# EAGLE design circuit (EAGLE 5.11)
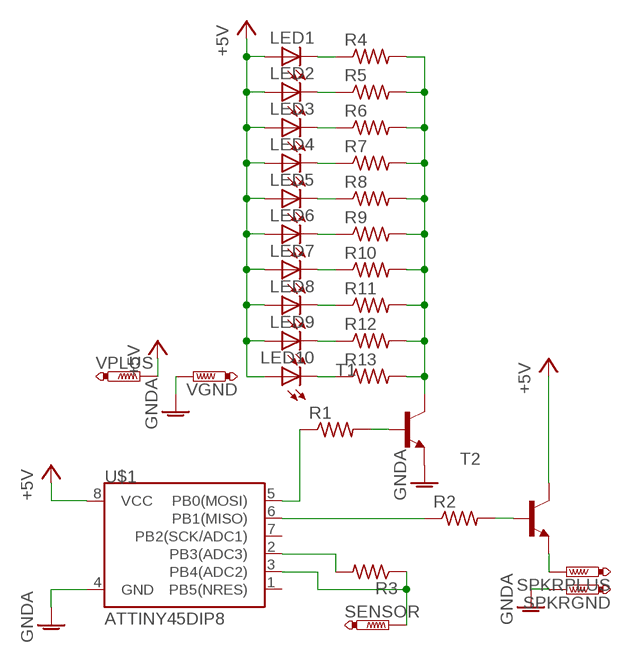
[diagram p0: schematic, sheet 1]

## Parts
LED1  LED5MM  [LED5MM]
LED2  LED5MM  [LED5MM]
LED3  LED5MM  [LED5MM]
LED4  LED5MM  [LED5MM]
LED5  LED5MM  [LED5MM]
LED6  LED5MM  [LED5MM]
LED7  LED5MM  [LED5MM]
LED8  LED5MM  [LED5MM]
LED9  LED5MM  [LED5MM]
LED10  LED5MM  [LED5MM]
R1  R-US_0204/5  [0204/5]
R2  R-US_0204/5  [0204/5]
R3  R-US_0204/5  [0204/5]
R4  R-US_0204/5  [0204/5]
R5  R-US_0204/5  [0204/5]
R6  R-US_0204/5  [0204/5]
R7  R-US_0204/5  [0204/5]
R8  R-US_0204/5  [0204/5]
R9  R-US_0204/5  [0204/5]
R10  R-US_0204/5  [0204/5]
R11  R-US_0204/5  [0204/5]
R12  R-US_0204/5  [0204/5]
R13  R-US_0204/5  [0204/5]
SENSOR  PTR1PAD1-17Y  [P1-17Y]
SPKRGND  PTR1PAD1-17Y  [P1-17Y]
SPKRPLUS  PTR1PAD1-17Y  [P1-17Y]
T1  -NPN-TO92-EBC  [TO92-EBC]
T2  -NPN-TO92-EBC  [TO92-EBC]
U$1  ATTINY45DIP8  [DIP08]
VGND  PTR1PAD1-17Y  [P1-17Y]
VPLUS  PTR1PAD1-17Y  [P1-17Y]

## Nets
+5V: LED1.A LED2.A LED3.A LED4.A LED5.A LED6.A LED7.A LED8.A LED9.A LED10.A T2.C U$1.8(VCC) VPLUS.TP
GNDA: SPKRGND.TP T1.E U$1.4(GND) VGND.TP
N$1: R3.2 U$1.2(PB3(ADC3))
N$3: R2.1 U$1.6(PB1(MISO))
N$4: R2.2 T2.B
N$5: R4.2 R5.2 R6.2 R7.2 R8.2 R9.2 R10.2 R11.2 R12.2 R13.2 T1.C
N$6: R1.2 T1.B
N$7: R1.1 U$1.5(PB0(MOSI))
N$8: SPKRPLUS.TP T2.E
N$9: LED1.K(C) R4.1
N$10: LED2.K(C) R5.1
N$11: LED3.K(C) R6.1
N$12: LED4.K(C) R7.1
N$13: LED5.K(C) R8.1
N$14: LED6.K(C) R9.1
N$15: LED7.K(C) R10.1
N$16: LED8.K(C) R11.1
N$17: LED9.K(C) R12.1
N$18: LED10.K(C) R13.1
N$19: R3.1 SENSOR.TP U$1.3(PB4(ADC2))
Unconnected: U$1.1(PB5(NRES)) U$1.7(PB2(SCK/ADC1))

## Library data of the parts
LED1-LED10 = led:LED: LED OSRAM: - CHIPLED LG R971, LG N971, LY N971, LG Q971, LY Q971, LO R971, LY R971 LH N974, LH R974 LS Q976, LO Q976, LY Q976 LO Q996 - Hyper CHIPLED LW Q18S LB Q993, LB Q99A, LB R99A - SideLED LS A670, LO A670, LY A670, LG A670, LP A670 LB A673, LV A673, LT A673, LW A673 LH A674 LY A675 LS A676, LA A676, LO A676, LY A676, LW A676 LS A679, LY A679, LG A679 - Hyper Micro SIDELED® LS Y876, LA Y876, LO Y876, LY Y876 LT Y87S - SmartLED LW L88C, LW L88S LB L89C, LB L89S, LG L890 LS L89K, LO L89K, LY L89K LS L896, LA L896, LO L896, LY L896 - TOPLED LS T670, LO T670, LY T670, LG T670, LP T670 LSG T670, LSP T670, LSY T670, LOP T670, LYG T670 LG T671, LOG T671, LSG T671 LB T673, LV T673, LT T673, LW T673 LH T674 LS T676, LA T676, LO T676, LY T676, LB T676, LH T676, LSB T676, LW T676 LB T67C, LV T67C, LT T67C, LS T67K, LO T67K, LY T67K, LW E67C LS E67B, LA E67B, LO E67B, LY E67B, LB E67C, LV E67C, LT E67C LW T67C LS T679, LY T679, LG T679 LS T770, LO T770, LY T770, LG T770, LP T770 LB T773, LV T773, LT T773, LW T773 LH T774 LS E675, LA E675, LY E675, LS T675 LS T776, LA T776, LO T776, LY T776, LB T776 LHGB T686 LT T68C, LB T68C - Hyper Mini TOPLED® LB M676 - Mini TOPLED Santana® LG M470 LS M47K, LO M47K, LY M47K Source: http://www.osram.convergy.de LUXEON: - LUMILED® LXK2-PW12-R00, LXK2-PW12-S00, LXK2-PW14-U00, LXK2-PW14-V00 LXK2-PM12-R00, LXK2-PM12-S00, LXK2-PM14-U00 LXK2-PE12-Q00, LXK2-PE12-R00, LXK2-PE12-S00, LXK2-PE14-T00, LXK2-PE14-U00 LXK2-PB12-K00, LXK2-PB12-L00, LXK2-PB12-M00, LXK2-PB14-N00, LXK2-PB14-P00, LXK2-PB14-Q00 LXK2-PR12-L00, LXK2-PR12-M00, LXK2-PR14-Q00, LXK2-PR14-R00 LXK2-PD12-Q00, LXK2-PD12-R00, LXK2-PD12-S00 LXK2-PH12-R00, LXK2-PH12-S00 LXK2-PL12-P00, LXK2-PL12-Q00, LXK2-PL12-R00 Source: www.luxeon.com KINGBRIGHT: KA-3528ASYC Source: www.kingbright.com
R1-R13 = rcl:R-US_: RESISTOR, American symbol
SENSOR SPKRGND SPKRPLUS VGND VPLUS = testpad:PTR1: TEST PIN
T1 T2 = transistor:*-NPN-: NPN Transistror BF959 corrected 2008.03.06
U$1 = SparkFun:ATTINY45: Atmel ATTiny45

## Board
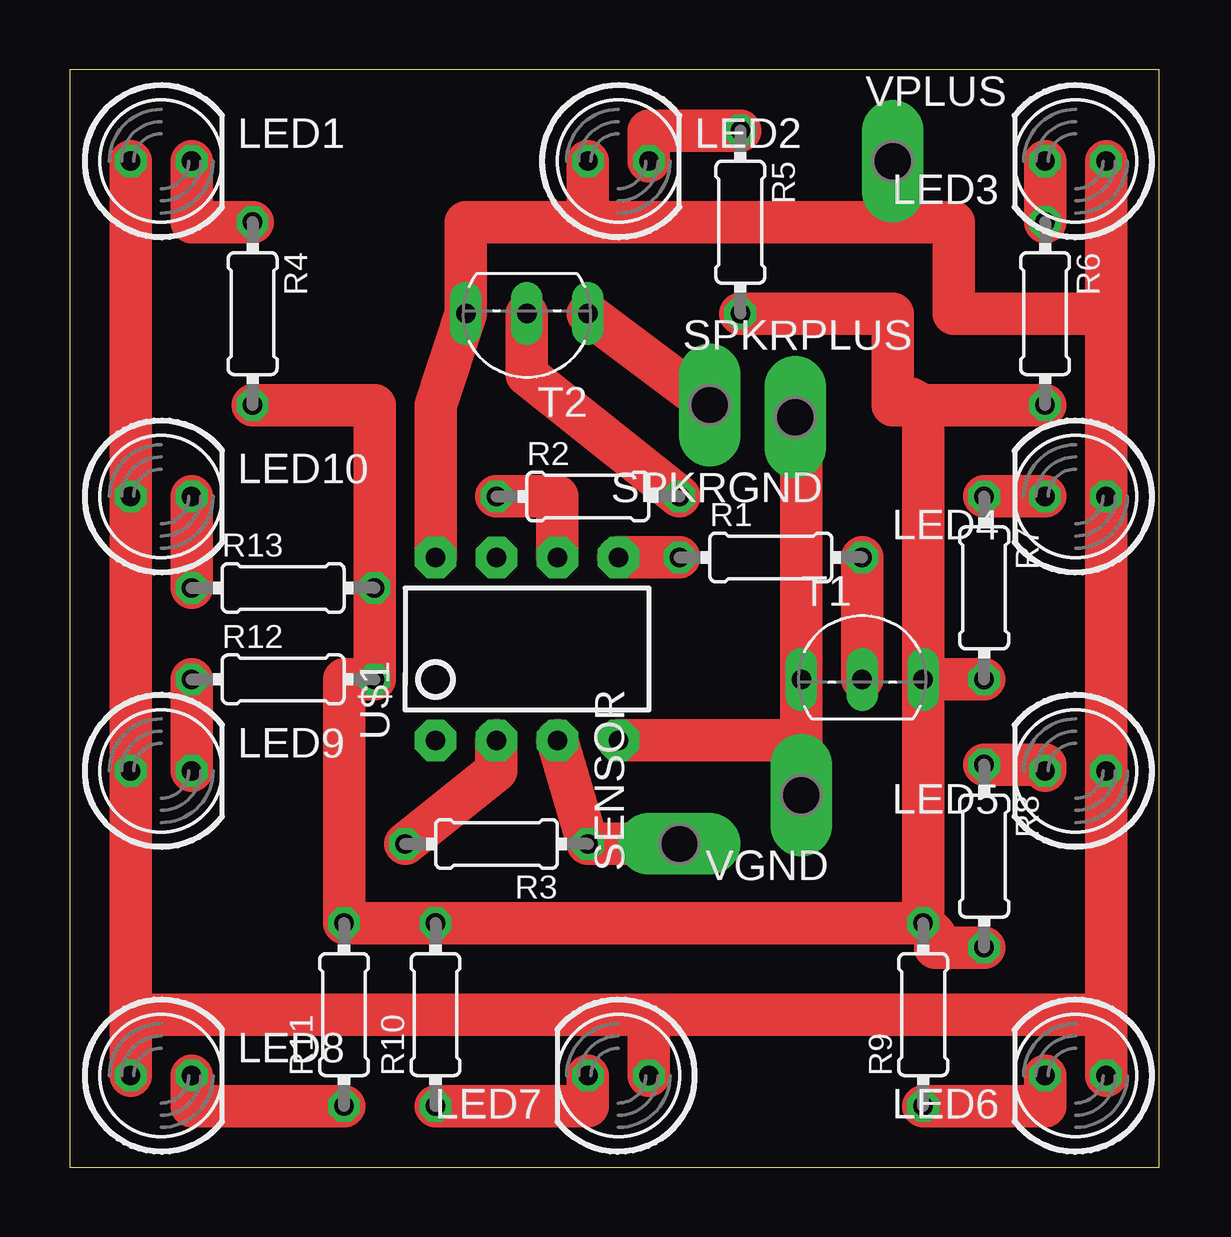
[diagram p1: board, top side]
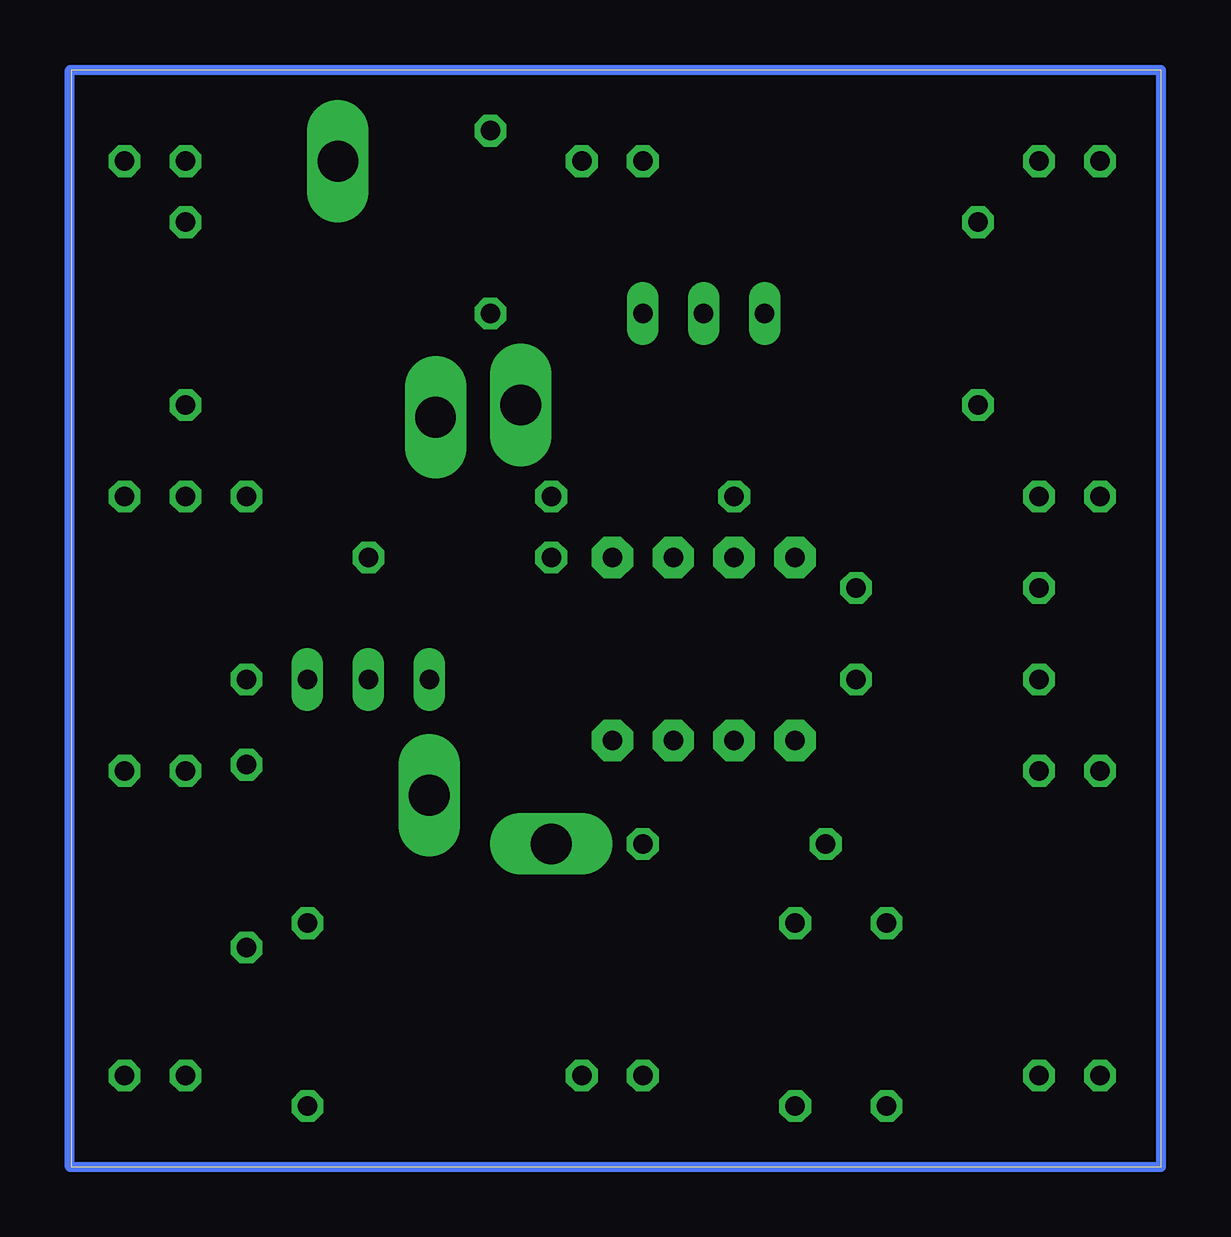
[diagram p2: board, bottom side, seen from below]

Size 45.39 x 45.71 mm. Coordinates in mm from the lower left corner, seen from the top.
Outline: 0,0 45.39,0 45.39,45.71 0,45.71 0,0
Copper layers (1*16): Top 0.035mm / dielectric 1.5mm / Bottom 0.035mm
Design rules "default *": minimum track width 70mil, minimum drill 24mil, track to track 10mil, track to pad 10mil, pad to pad 10mil, via to via 10mil, smd to smd 8mil, copper to edge 10mil, drill to drill 8mil, minimum pad ring 10mil, minimum via ring 8mil, stop-mask expansion 4mil, vias tented up to drill 0mil, thermal gap 10mil

### Footprints (pad centres in the part's own frame; a part is rotated, then mirrored left to right if it is on the bottom)
LED5MM = drill 0.813 octagon: A -1.27,0; K 1.27,0
0204/7 = drill 0.813 octagon: 1 -3.81,0; 2 3.81,0
P1-17Y = drill 1.702 pad 2.121 long: TP 0,0
TO92-EBC = drill 0.813 long: B 0,-1.27; C 2.54,-1.27; E -2.54,-1.27
DIP08 = drill 0.813 pad 1.727 octagon: 1 -3.81,-3.81; 2 -1.27,-3.81; 3 1.27,-3.81; 4 3.81,-3.81; 5 3.81,3.81; 6 1.27,3.81; 7 -1.27,3.81; 8 -3.81,3.81

### Placement (x,y rotation side)
LED1  3.81,41.91 0 top
LED2  22.86,41.91 0 top
LED3  41.91,41.91 180 top
LED4  41.91,27.94 180 top
LED5  41.91,16.51 180 top
LED6  41.91,3.81 180 top
LED7  22.86,3.81 180 top
LED8  3.81,3.81 0 top
LED9  3.81,16.51 0 top
LED10  3.81,27.94 0 top
R1  [0204/7]  29.21,25.4 0 top
R2  [0204/7]  21.59,27.94 0 top
R3  [0204/7]  17.78,13.46 180 top
R4  [0204/7]  7.62,35.56 270 top
R5  [0204/7]  27.94,39.37 270 top
R6  [0204/7]  40.64,35.56 270 top
R7  [0204/7]  38.1,24.13 270 top
R8  [0204/7]  38.1,12.95 270 top
R9  [0204/7]  35.56,6.35 90 top
R10  [0204/7]  15.24,6.35 90 top
R11  [0204/7]  11.43,6.35 90 top
R12  [0204/7]  8.89,20.32 0 top
R13  [0204/7]  8.89,24.13 0 top
SENSOR  25.4,13.46 90 top
SPKRGND  30.23,31.24 180 top
SPKRPLUS  26.67,31.75 0 top
T1  33.02,21.59 0 top
T2  19.05,34.29 180 top
U$1  19.05,21.59 0 top
VGND  30.48,15.49 180 top
VPLUS  34.29,41.91 0 top

### Tracks (layer width: path | path; a pad name or v marks a point on that pad's centre or on a via)
+5V
  Top 1.778: 2.54,6.35 LED9.A LED10.A LED1.A | LED8.A 2.54,6.35 | U$1.8 15.24,31.75 T2.C 16.51,39.37 21.59,39.37 | 34.29,39.37 21.59,39.37 | 21.59,39.37 LED2.A | 24.13,6.35 43.18,6.35 | 43.18,6.35 LED6.A | 43.18,6.35 LED5.A LED4.A 43.18,35.56 | 43.18,35.56 LED3.A | 34.29,39.37 36.83,39.37 36.83,35.56 43.18,35.56 | 34.29,39.37 VPLUS.TP | 2.54,6.35 24.13,6.35 | 24.13,6.35 LED7.A
GNDA
  Top 1.778: 30.48,17.78 VGND.TP | 30.48,17.78 T1.E 30.48,30.99 SPKRGND.TP | U$1.4 30.48,17.78
N$1
  Top 1.778: R3.2 17.78,16.51 U$1.2
N$2
  Bottom 0.406: 0,45.72 0,0 45.47,0 45.47,45.72 0,45.72
N$3
  Top 1.778: R2.1 20.32,27.94 U$1.6
N$4
  Top 1.778: R2.2 19.05,33.02 T2.B
N$5
  Top 1.778: R4.2 12.7,31.75 R13.2 R12.2 11.43,20.32 R11.2 R10.2 R9.2 | R5.2 34.29,35.56 34.29,32 | 34.29,32 34.29,31.75 35.56,31.75 | T1.C 35.56,31.75 | 35.56,31.75 R6.2 | R9.2 T1.C | 34.29,32 35.05,32 35.56,31.75 | R8.2 36.07,9.14 36.07,9.65 R9.2 | T1.C R7.2
N$6
  Top 1.778: T1.B R1.2
N$7
  Top 1.778: U$1.5 R1.1
N$8
  Top 1.778: SPKRPLUS.TP T2.E
N$9
  Top 1.778: R4.1 5.08,39.37 LED1.K
N$10
  Top 1.778: LED2.K 24.13,43.18 R5.1
N$11
  Top 1.778: R6.1 LED3.K
N$12
  Top 1.778: R7.1 LED4.K
N$13
  Top 1.778: R8.1 40.64,16.76 LED5.K
N$14
  Top 1.778: R9.1 40.64,2.54 LED6.K
N$15
  Top 1.778: R10.1 21.59,2.54 LED7.K
N$16
  Top 1.778: LED8.K 5.08,2.54 R11.1
N$17
  Top 1.778: LED9.K R12.1
N$18
  Top 1.778: R13.1 LED10.K
N$19
  Top 1.778: SENSOR.TP R3.1 U$1.3